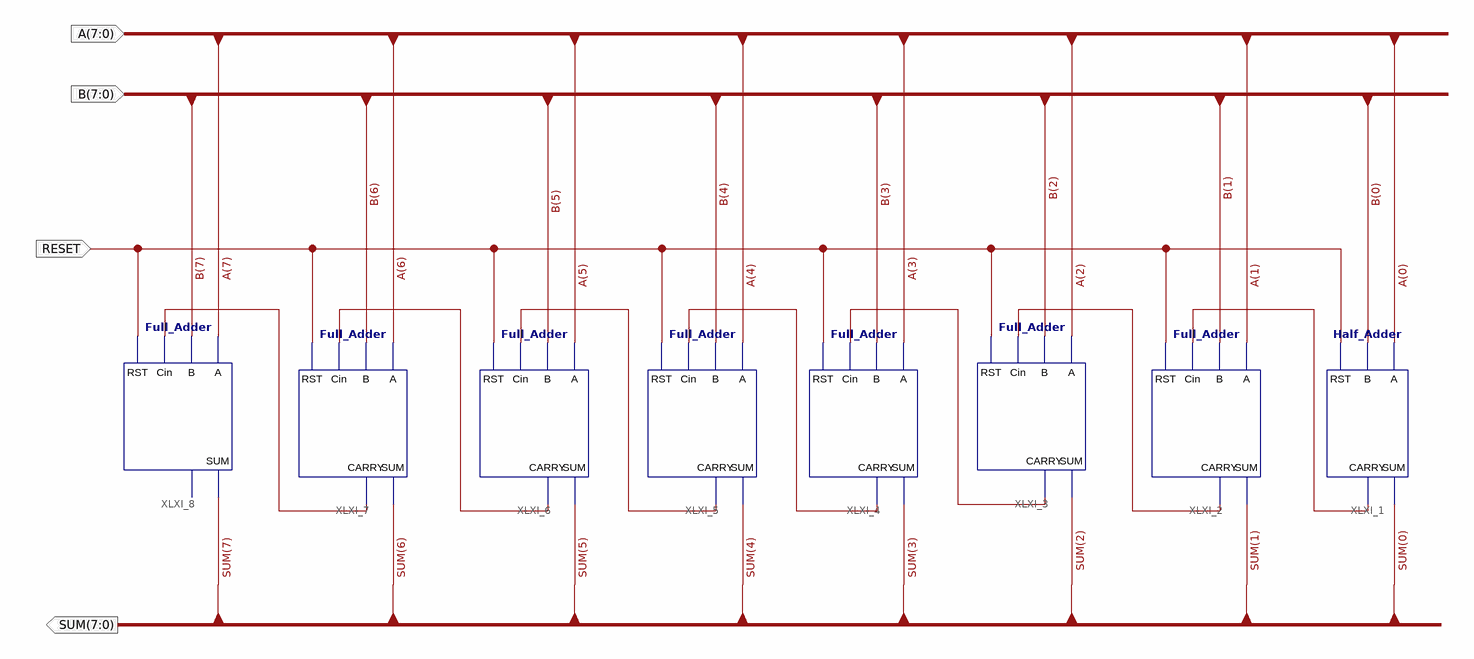
[diagram p0: schematic sheet 1]
// Xilinx ISE schematic Eight_Bit_Adder.sch (spartan6) as structural Verilog: 8 symbols, 4 ports
module Eight_Bit_Adder (
  input  [7:0] B,
  input  [7:0] A,
  input  RESET,
  output [7:0] SUM
);

  wire XLXN_2, XLXN_4, XLXN_6, XLXN_8, XLXN_10, XLXN_12, XLXN_14;

  Full_Adder XLXI_8 (.A(A[7]), .B(B[7]), .Cin(XLXN_14), .RST(RESET), .SUM(SUM[7]));  // open: CARRY
  Full_Adder XLXI_7 (.A(A[6]), .B(B[6]), .CARRY(XLXN_14), .Cin(XLXN_12), .RST(RESET), .SUM(SUM[6]));
  Full_Adder XLXI_6 (.A(A[5]), .B(B[5]), .CARRY(XLXN_12), .Cin(XLXN_8), .RST(RESET), .SUM(SUM[5]));
  Full_Adder XLXI_5 (.A(A[4]), .B(B[4]), .CARRY(XLXN_8), .Cin(XLXN_10), .RST(RESET), .SUM(SUM[4]));
  Full_Adder XLXI_2 (.A(A[1]), .B(B[1]), .CARRY(XLXN_4), .Cin(XLXN_2), .RST(RESET), .SUM(SUM[1]));
  Full_Adder XLXI_4 (.A(A[3]), .B(B[3]), .CARRY(XLXN_10), .Cin(XLXN_6), .RST(RESET), .SUM(SUM[3]));
  Full_Adder XLXI_3 (.A(A[2]), .B(B[2]), .CARRY(XLXN_6), .Cin(XLXN_4), .RST(RESET), .SUM(SUM[2]));
  Half_Adder XLXI_1 (.A(A[0]), .B(B[0]), .CARRY(XLXN_2), .RST(RESET), .SUM(SUM[0]));
endmodule
